# Altium schematic sheet [02] - Power_Supplies - Copy.SchDoc
size A4
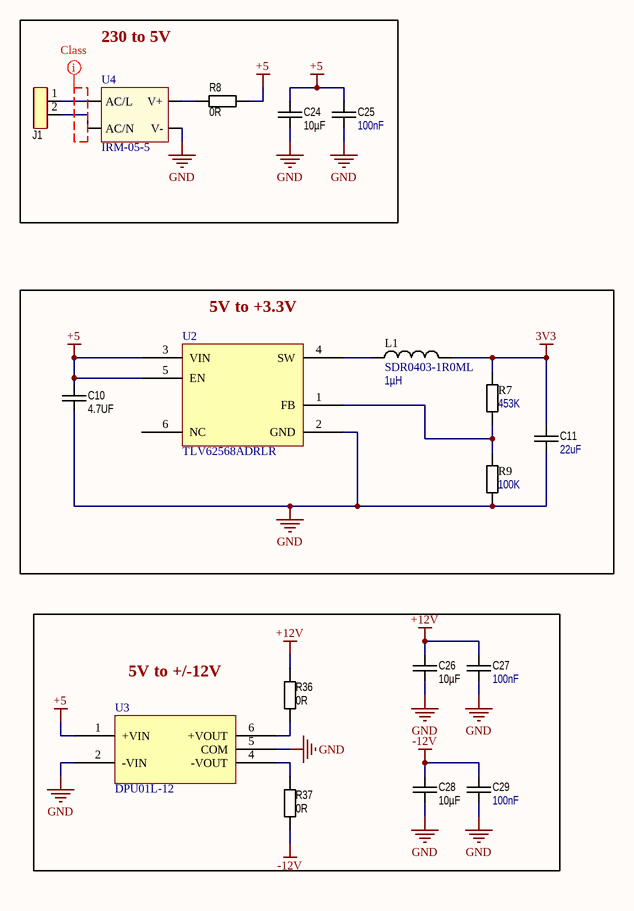
[diagram p0: [02] - Power_Supplies - Copy.SchDoc]

## Parts
C10  value 4.7UF  [CAP 0603/1608]  (hidden comment: C0603C475K9PACTU)
C11  value 22uF  [CAP 0603/1608]  (hidden comment: CAP CER 22UF 6.3V X5R 0603)
C24  value 10µF  [CAP 0603/1608]  (hidden comment: GRM188R61E106MA73D)
C25  value 100nF  [CAP 0603/1608]  (hidden comment: CAP 100nF 0603 50V 20% Y5V)
C26  value 10µF  [CAP 0603/1608]  (hidden comment: GRM188R61E106MA73D)
C27  value 100nF  [CAP 0603/1608]  (hidden comment: CAP 100nF 0603 50V 20% Y5V)
C28  value 10µF  [CAP 0603/1608]  (hidden comment: GRM188R61E106MA73D)
C29  value 100nF  [CAP 0603/1608]  (hidden comment: CAP 100nF 0603 50V 20% Y5V)
J1  1985195  [BLK_02P_3.5MM]  (value not drawn)
L1  SDR0403-1R0ML  value 1µH  [IND_NonStandard]
R7  value 453K  [R0603]  (hidden comment: RES SMD 453K OHM 0.1% 1/16W 0603)
R8  value 0R  [R0603]  (hidden comment: RES 0R 0603 JUMPER)
R9  value 100K  [R0603]  (hidden comment: RES SMD 100K OHM 0.1% 1/10W 0603)
R36  value 0R  [R0603]  (hidden comment: RES 0R 0603 JUMPER)
R37  value 0R  [R0603]  (hidden comment: RES 0R 0603 JUMPER)
U2  TLV62568ADRLR  [SOT-563]
U3  DPU01L-12  [SIP7]
U4  IRM-05-5  [IRM-05-5_DIP-4]

## Blocks framed on the sheet
230 to 5V: C24 C25 J1 R8 U4
5V to +3.3V: C10 C11 L1 R7 R9 U2
5V to +/-12V: C26-C29 R36 R37 U3

## Nets
3V3: C11.1 L1.2 R7.1
+5: C10.1 C24.1 C25.1 R8.2 U2.3(VIN) U2.5(EN) U3.1(+VIN)
+12V: C26.1 C27.1 R36.2
-12V: C28.1 C29.1 R37.1
GND: C10.2 C11.2 C24.2 C25.2 C26.2 C27.2 C28.2 C29.2 R9.2 U2.2(GND) U3.2(-VIN) U3.5(COM) U4.V-
NetJ1_1: J1.1 U4.AC/L
NetJ1_2: J1.2 U4.AC/N
NetL1_1: L1.1 U2.4(SW)
NetR7_2: R7.2 R9.1 U2.1(FB)
NetR8_1: R8.1 U4.V+
NetR36_1: R36.1 U3.6(+VOUT)
NetR37_2: R37.2 U3.4(-VOUT)

Not connected (* = marked no-connect by the designer): U2 6(NC)

## Layout directives
net class creepage: (no net found under the mark)

## Library data of the parts
C10 = CAPC_4.7UF_0603_6.3V: 4.7µF ±10% 6.3V Ceramic Capacitor X5R 0603 (1608 Metric) /; Manufacturer: KEMET; Type: SMD; Package: 0603; PartNumber: C0603C475K9PACTU; Price1: 0.17000; Price1000: 0.03280; Link: https://www.digikey.com/product-detail/en/kemet/C0603C475K9PACTU/399-3482-1-ND/754775; Tolerance: ±10%; Price100: 0.05650; Voltage: 6.3V; Price10: 0.12000
C11 = CAPC_22uF_0603_6.3V: 22µF ±20% 6.3V Ceramic Capacitor X5R 0603 (1608 Metric); PartNumber: GRM188R60J226MEA0D; Manufacturer: Murata Electronics; Type: SMD; Package: 0603; Price1: 0.26000; Price1000: 0.06176; Link: https://www.digikey.com/product-detail/en/murata-electronics/GRM188R60J226MEA0D/490-7611-1-ND/4280544; Tolerance: ±20%; Price100: 0.10000; Voltage: 6.3V; Price10: 0.17600
C24 C26 C28 = CAPC_10uF_0603_25V: 10µF ±20% 25V Ceramic Capacitor X5R 0603 (1608 Metric); Manufacturer: Murata Electronics; Type: SMD; Package: 0603; PartNumber: GRM188R61E106MA73D; Price1: 0.42000; Price1000: 0.11123; Link: https://www.digikey.com/product-detail/en/murata-electronics/GRM188R61E106MA73D/490-7202-1-ND/3900486; Tolerance: ±20%; Price100: 0.17560; Voltage: 25V; Price10: 0.29300
C25 C27 C29 = CAPC_100NF_0603_50V: 0.1µF ±20% 50V Ceramic Capacitor X7R 0603 (1608 Metric); PartNumber: C0603C104M5RACTU; Manufacturer: KEMET; Type: SMD; Package: 0603; Price1: 0.09000; Price1000: 0.00886; Link: https://www.digikey.lt/product-detail/en/kemet/C0603C104M5RACTU/399-7845-1-ND/3471568; Tolerance: ±20%; Price100: 0.01580; Voltage: 50V; Price10: 0.03500
J1 = BLK_02_3.5: 2 Position Wire to Board Terminal Block 45° (135°) Angle with Board 0.138" (3.50mm) Through Hole; Manufacturer: Phoenix Contact; Type: TH; PartNumber: 1985195; Link: https://www.digikey.com/product-detail/en/phoenix-contact/1985195/277-1622-ND/568659; Price1: 0.32000; Price100: 0.28090; Footprint: =Footprint; Price10: 0.30200; Price1000: 0.22313
L1 = IND_1uH: 1µH Unshielded Wirewound Inductor 3.8A 33mOhm Max Nonstandard; Manufacturer: Bourns Inc.; Type: SMD; Package: Nonstandard; PartNumber: SDR0403-1R0ML; Link: https://www.digikey.com/product-detail/en/bourns-inc/SDR0403-1R0ML/SDR0403-1R0MLCT-ND/2127084; Price1: 0.60000; Price1000: 0.25415; Alternative: *; Footprint: =Footprint; Price10: 0.52300; Price100: 0.37380; Availability: Available
R7 = RES_453k_0603_0.1%: 453 kOhms ±0.1% 0.063W, 1/16W Chip Resistor 0603 (1608 Metric) Thin Film; PartNumber: RN73C1J453KBTD; Manufacturer: TE Connectivity Passive Product; Type: SMD; Package: 0603; Link: https://www.digikey.com/product-detail/en/te-connectivity-passive-product/RN73C1J453KBTD/A124752CT-ND/6557797; Price1: 0.80000; Price1000: 0.26247; Price100: 0.44860; Price10: 0.66800; Tolerance: ±0.1%
R8 R36 R37 = RES_0R_0603_JUMPER: PartNumber: RC0603JR-070RL; Manufacturer: Yageo; Type: SMT; Package: 0603; Link: https://www.digikey.com/product-detail/en/yageo/RC0603JR-070RL/311-0.0GRTR-ND/726675; Price1: 0.1; Price1000: 0.00396; Price10: 0.022; Price100: 0.0088
R9 = RES_100k_0603_0.1%: 100 kOhms ±0.1% 0.1W, 1/10W Chip Resistor 0603 (1608 Metric) Thin Film; PartNumber: RT0603BRD07100KL; Manufacturer: Yageo; Type: SMD; Package: 0603; Link: https://www.digikey.com/product-detail/en/yageo/RT0603BRD07100KL/YAG1235CT-ND/4340588; Price1: 0.38000; Price1000: 0.05233; Price100: 0.12500; Price10: 0.32000; Tolerance: ±0.1%
U2 = TLV62568ADRLR: Buck Switching Regulator IC Positive Adjustable 0.6V 1 Output 1A SOT-563, SOT-666; Manufacturer: Texas Instruments; Alternative: *; Package: SOT563; Price1000: 0.41818; PartNumber: TLV62568ADRLR; Price1: 0.99000; Price10: 0.88100; Type: SMD; Price100: 0.64220; Footprint: =FOOTPRINT; Link: https://www.digikey.com/product-detail/en/texas-instruments/TLV62568ADRLR/296-50407-1-ND/9685546
U3 = DC/DC-DPU01L-12: Isolated Module DC DC Converter 2 Output 12V -12V 42mA, 42mA 4.5V - 5.5V Input; Manufacturer: MEAN WELL USA Inc.; Alternative: *; Footprint: =Footprint; Link: https://www.digikey.com/products/en?keywords=DPU01L-12; Package: 6-SIP; PartNumber: DPU01L-12; Type: TH; Price1: 3.22000; Price10: 3.12500; Price100: 2.94080; Price1000: 2.94080; Value: *
U4 = AC/DC-IRM-05-5: Enclosed AC DC Converter 1 Output 5V    1A 85 ~ 305 VAC, 120 ~ 430 VDC Input; Manufacturer: MEAN WELL USA Inc.; Alternative: *; Footprint: =Footprint; Link: https://www.digikey.com/product-detail/en/mean-well-usa-inc/IRM-05-5/1866-3027-ND/7704652; Package: 4-DIP Module; PartNumber: IRM-05-5; Type: TH; Price1: 8.37000; Price10: 8.37000; Price100: 7.43860; Price1000: 7.43860; Value: *